# EAGLE design battleswitch_v1 (EAGLE 7.2.0)
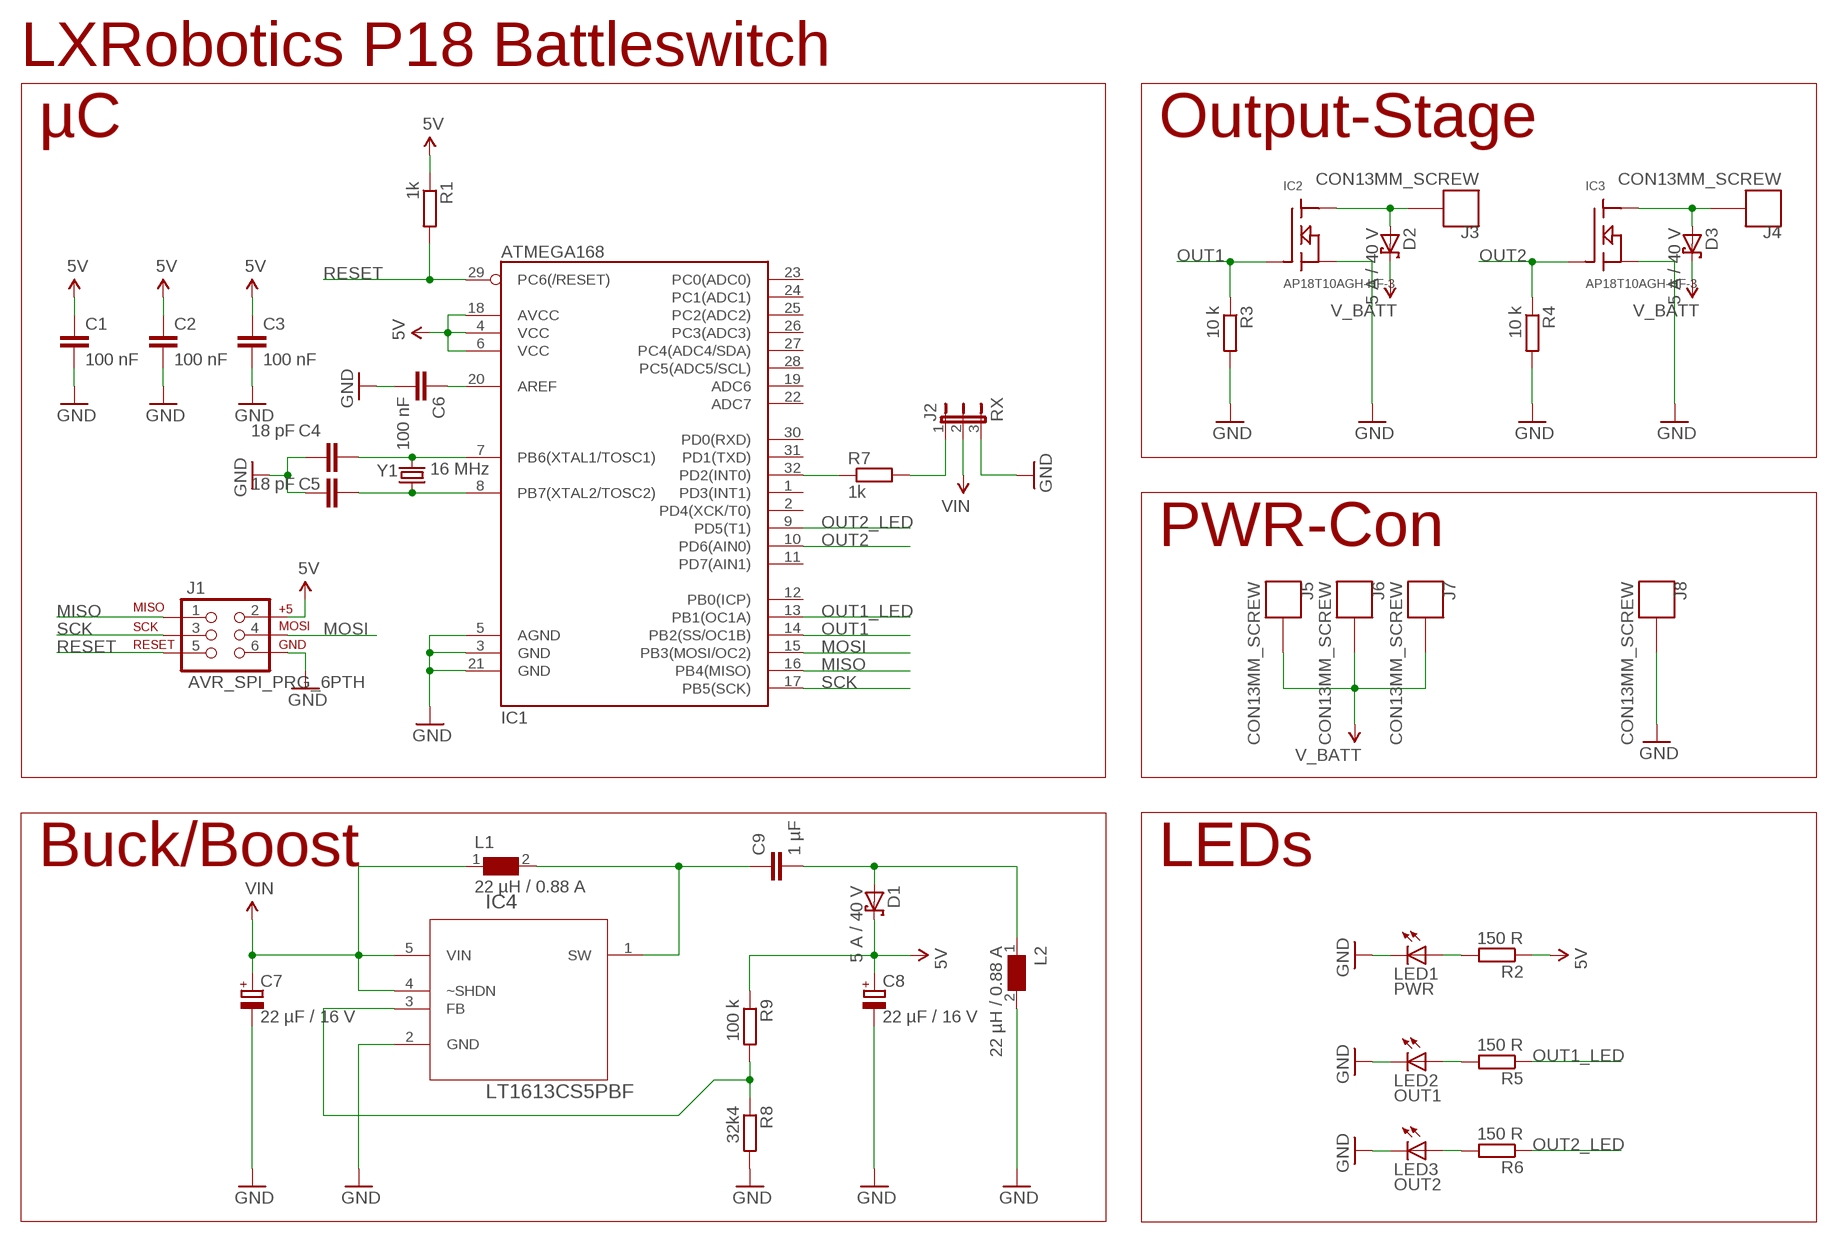
[diagram p0: schematic, sheet 1]

## Parts
C1  100 nF  C-EUC0805  [C0805]
C2  100 nF  C-EUC0805  [C0805]
C3  100 nF  C-EUC0805  [C0805]
C4  18 pF  C-EUC0805  [C0805]
C5  18 pF  C-EUC0805  [C0805]
C6  100 nF  C-EUC0805  [C0805]
C7  22 µF / 16 V  CPOL-EUC  [PANASONIC_C]
C8  22 µF / 16 V  CPOL-EUC  [PANASONIC_C]
C9  1 µF  C-EUC0805  [C0805]
D1  5 A / 40 V  SCHOTTKY-DIODESMC  [SMC]
D2  5 A / 40 V  SCHOTTKY-DIODESMC  [SMC]
D3  5 A / 40 V  SCHOTTKY-DIODESMC  [SMC]
IC1  ATMEGA168  [TQFP32-08]
IC2  AP18T10AGH-HF-3  [TO252]
IC3  AP18T10AGH-HF-3  [TO252]
IC4  LT1613CS5PBF  [SOT95P280X145-5N]
J1  AVR_SPI_PRG_6PTH  [2X3]
J2  RX  JP2E  [JP2]
J3  CON13MM_SCREW  [CON1_3MM_SCREW]
J4  CON13MM_SCREW  [CON1_3MM_SCREW]
J5  CON13MM_SCREW  [CON1_3MM_SCREW]
J6  CON13MM_SCREW  [CON1_3MM_SCREW]
J7  CON13MM_SCREW  [CON1_3MM_SCREW]
J8  CON13MM_SCREW  [CON1_3MM_SCREW]
L1  22 µH / 0.88 A  WE-TPC-744042220_4818/4828  [WE-TPC_4818/4828]
L2  22 µH / 0.88 A  WE-TPC-744042220_4818/4828  [WE-TPC_4818/4828]
LED1  PWR  LEDCHIP-LED0805  [CHIP-LED0805]
LED2  OUT1  LEDCHIP-LED0805  [CHIP-LED0805]
LED3  OUT2  LEDCHIP-LED0805  [CHIP-LED0805]
R1  1k  R-EU_R0805  [R0805]
R2  150 R  R-EU_R0805  [R0805]
R3  10 k  R-EU_R0805  [R0805]
R4  10 k  R-EU_R0805  [R0805]
R5  150 R  R-EU_R0805  [R0805]
R6  150 R  R-EU_R0805  [R0805]
R7  1k  R-EU_R0805  [R0805]
R8  32k4  R-EU_R0805  [R0805]
R9  100 k  R-EU_R0805  [R0805]
Y1  16 MHz  CRYSTALHC49US  [HC49US]

## Nets
5V: C1.1 C2.1 C3.1 C8.+ D1.C IC1.4(VCC) IC1.6(VCC) IC1.18(AVCC) J1.2 R1.1 R2.1 R9.1
GND: C1.2 C2.2 C3.2 C4.2 C5.2 C6.2 C7.- C8.- IC1.3(GND) IC1.5(AGND) IC1.21(GND) IC2.S IC3.S IC4.2(GND) J1.6 J2.3 J8.P$1 L2.2 LED1.C LED2.C LED3.C R3.2 R4.2 R8.2
MISO: IC1.16(PB4(MISO)) J1.1
MOSI: IC1.15(PB3(MOSI/OC2)) J1.4
N$1: J2.1 R7.2
N$2: C6.1 IC1.20(AREF)
N$3: IC1.32(PD2(INT0)) R7.1
N$4: LED2.A R5.2
N$5: LED3.A R6.2
N$6: D2.A IC2.D J3.P$1
N$7: D3.A IC3.D J4.P$1
N$9: C9.1 IC4.1(SW) L1.2
N$10: IC4.3(FB) R8.1 R9.2
N$11: C9.2 D1.A L2.1
N$22: C4.1 IC1.7(PB6(XTAL1/TOSC1)) Y1.2
N$23: C5.1 IC1.8(PB7(XTAL2/TOSC2)) Y1.1
N$37: LED1.A R2.2
OUT1: IC1.14(PB2(SS/OC1B)) IC2.G R3.1
OUT1_LED: IC1.13(PB1(OC1A)) R5.1
OUT2: IC1.10(PD6(AIN0)) IC3.G R4.1
OUT2_LED: IC1.9(PD5(T1)) R6.1
RESET: IC1.29(PC6(/RESET)) J1.5 R1.2
SCK: IC1.17(PB5(SCK)) J1.3
V_BATT: D2.C D3.C J5.P$1 J6.P$1 J7.P$1
VIN: C7.+ IC4.4(~SHDN) IC4.5(VIN) J2.2 L1.1
Unconnected: IC1.1(PD3(INT1)) IC1.2(PD4(XCK/T0)) IC1.11(PD7(AIN1)) IC1.12(PB0(ICP)) IC1.19(ADC6) IC1.22(ADC7) IC1.23(PC0(ADC0)) IC1.24(PC1(ADC1)) IC1.25(PC2(ADC2)) IC1.26(PC3(ADC3)) IC1.27(PC4(ADC4/SDA)) IC1.28(PC5(ADC5/SCL)) IC1.30(PD0(RXD)) IC1.31(PD1(TXD))

## Notes on the sheet
- LXRobotics P18 Battleswitch
- µC | Output-Stage
- PWR-Con
- Buck/Boost | LEDs

## Library data of the parts
C1-C6 C9 = resistor:C-EU: CAPACITOR, European symbol
C7 C8 = resistor:CPOL-EU: POLARIZED CAPACITOR, European symbol
D1-D3 = diode:SCHOTTKY-DIODE: Schottky Diode
IC1 = SparkFun-DigitalIC:ATMEGA168: Atmel 32-pin 8-bit micro, 16k flash.
IC2 IC3 = lxrobotics:AP18T10AGH-HF-3
IC4 = lxrobotics_ic:LT1613CS5PBF: DC/DC Converter; MPN: LT1613CS5#PBF; OC_FARNELL: 2115857; OC_NEWARK: 61M3347; PACKAGE: SOT-23-5; SUPPLIER: Linear Technology
J1 = SparkFun-Connectors:AVR_SPI_PRG_6: AVR ISP 6 Pin This is the reduced ISP connector for AVR programming. Common on Arduino. This footprint will take up less PCB space and can be used with a 10-pin to 6-pin adapter such as SKU: BOB-08508
J2 = jumper:JP2E: JUMPER
J3-J8 = lxrobotics_connectors:CON1
L1 L2 = WE-TPC:WE-TPC: Shielded Tiny Power Inductor WE-TPC - Extremely flat power inductor - High current capability - High reliability and perfect soldering characteristics because of integrated soldering pad - magnetically shielded -- Portable power like PDA, digital camera, PCMICA-cards and displays -- DC/DC-converter -- Recommended for switching regulator IC's from Linear Technology, National Semiconductor, Texas Instruments and Fairchild Semiconductor; MPN: 744042220; OC_FARNELL: 1635843; OC_NEWARK: 08P2481; PACKAGE: 4818; SUPPLIER: WURTH ELEKTRONIK
LED1-LED3 = led:LED: LED OSRAM: - CHIPLED LG R971, LG N971, LY N971, LG Q971, LY Q971, LO R971, LY R971 LH N974, LH R974 LS Q976, LO Q976, LY Q976 LO Q996 - Hyper CHIPLED LW Q18S LB Q993, LB Q99A, LB R99A - SideLED LS A670, LO A670, LY A670, LG A670, LP A670 LB A673, LV A673, LT A673, LW A673 LH A674 LY A675 LS A676, LA A676, LO A676, LY A676, LW A676 LS A679, LY A679, LG A679 - Hyper Micro SIDELED® LS Y876, LA Y876, LO Y876, LY Y876 LT Y87S - SmartLED LW L88C, LW L88S LB L89C, LB L89S, LG L890 LS L89K, LO L89K, LY L89K LS L896, LA L896, LO L896, LY L896 - TOPLED LS T670, LO T670, LY T670, LG T670, LP T670 LSG T670, LSP T670, LSY T670, LOP T670, LYG T670 LG T671, LOG T671, LSG T671 LB T673, LV T673, LT T673, LW T673 LH T674 LS T676, LA T676, LO T676, LY T676, LB T676, LH T676, LSB T676, LW T676 LB T67C, LV T67C, LT T67C, LS T67K, LO T67K, LY T67K, LW E67C LS E67B, LA E67B, LO E67B, LY E67B, LB E67C, LV E67C, LT E67C LW T67C LS T679, LY T679, LG T679 LS T770, LO T770, LY T770, LG T770, LP T770 LB T773, LV T773, LT T773, LW T773 LH T774 LS E675, LA E675, LY E675, LS T675 LS T776, LA T776, LO T776, LY T776, LB T776 LHGB T686 LT T68C, LB T68C - Hyper Mini TOPLED® LB M676 - Mini TOPLED Santana® LG M470 LS M47K, LO M47K, LY M47K Source: http://www.osram.convergy.de LUXEON: - LUMILED® LXK2-PW12-R00, LXK2-PW12-S00, LXK2-PW14-U00, LXK2-PW14-V00 LXK2-PM12-R00, LXK2-PM12-S00, LXK2-PM14-U00 LXK2-PE12-Q00, LXK2-PE12-R00, LXK2-PE12-S00, LXK2-PE14-T00, LXK2-PE14-U00 LXK2-PB12-K00, LXK2-PB12-L00, LXK2-PB12-M00, LXK2-PB14-N00, LXK2-PB14-P00, LXK2-PB14-Q00 LXK2-PR12-L00, LXK2-PR12-M00, LXK2-PR14-Q00, LXK2-PR14-R00 LXK2-PD12-Q00, LXK2-PD12-R00, LXK2-PD12-S00 LXK2-PH12-R00, LXK2-PH12-S00 LXK2-PL12-P00, LXK2-PL12-Q00, LXK2-PL12-R00 Source: www.luxeon.com KINGBRIGHT: KA-3528ASYC Source: www.kingbright.com
R1-R9 = resistor:R-EU_: RESISTOR, European symbol
Y1 = SparkFun-FreqCtrl:CRYSTAL: Various standard crystals. Proven footprints. Spark Fun Electronics SKU : COM-00534

## Board
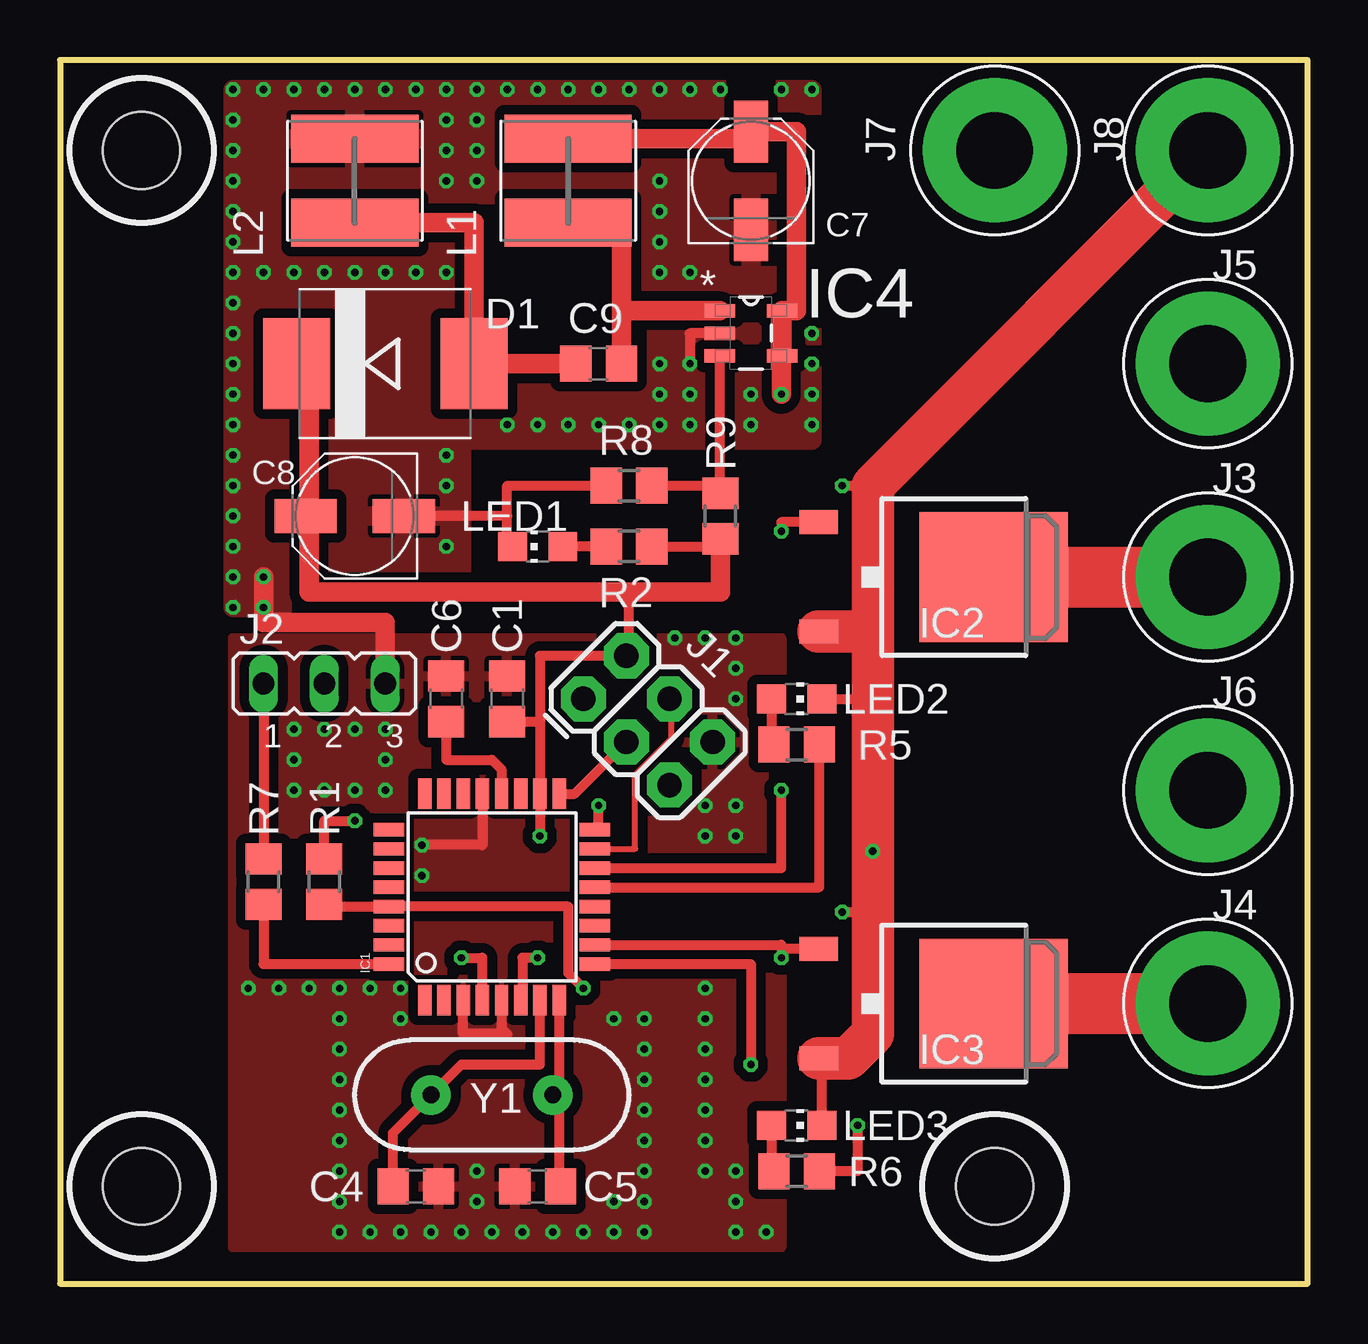
[diagram p1: board, top side]
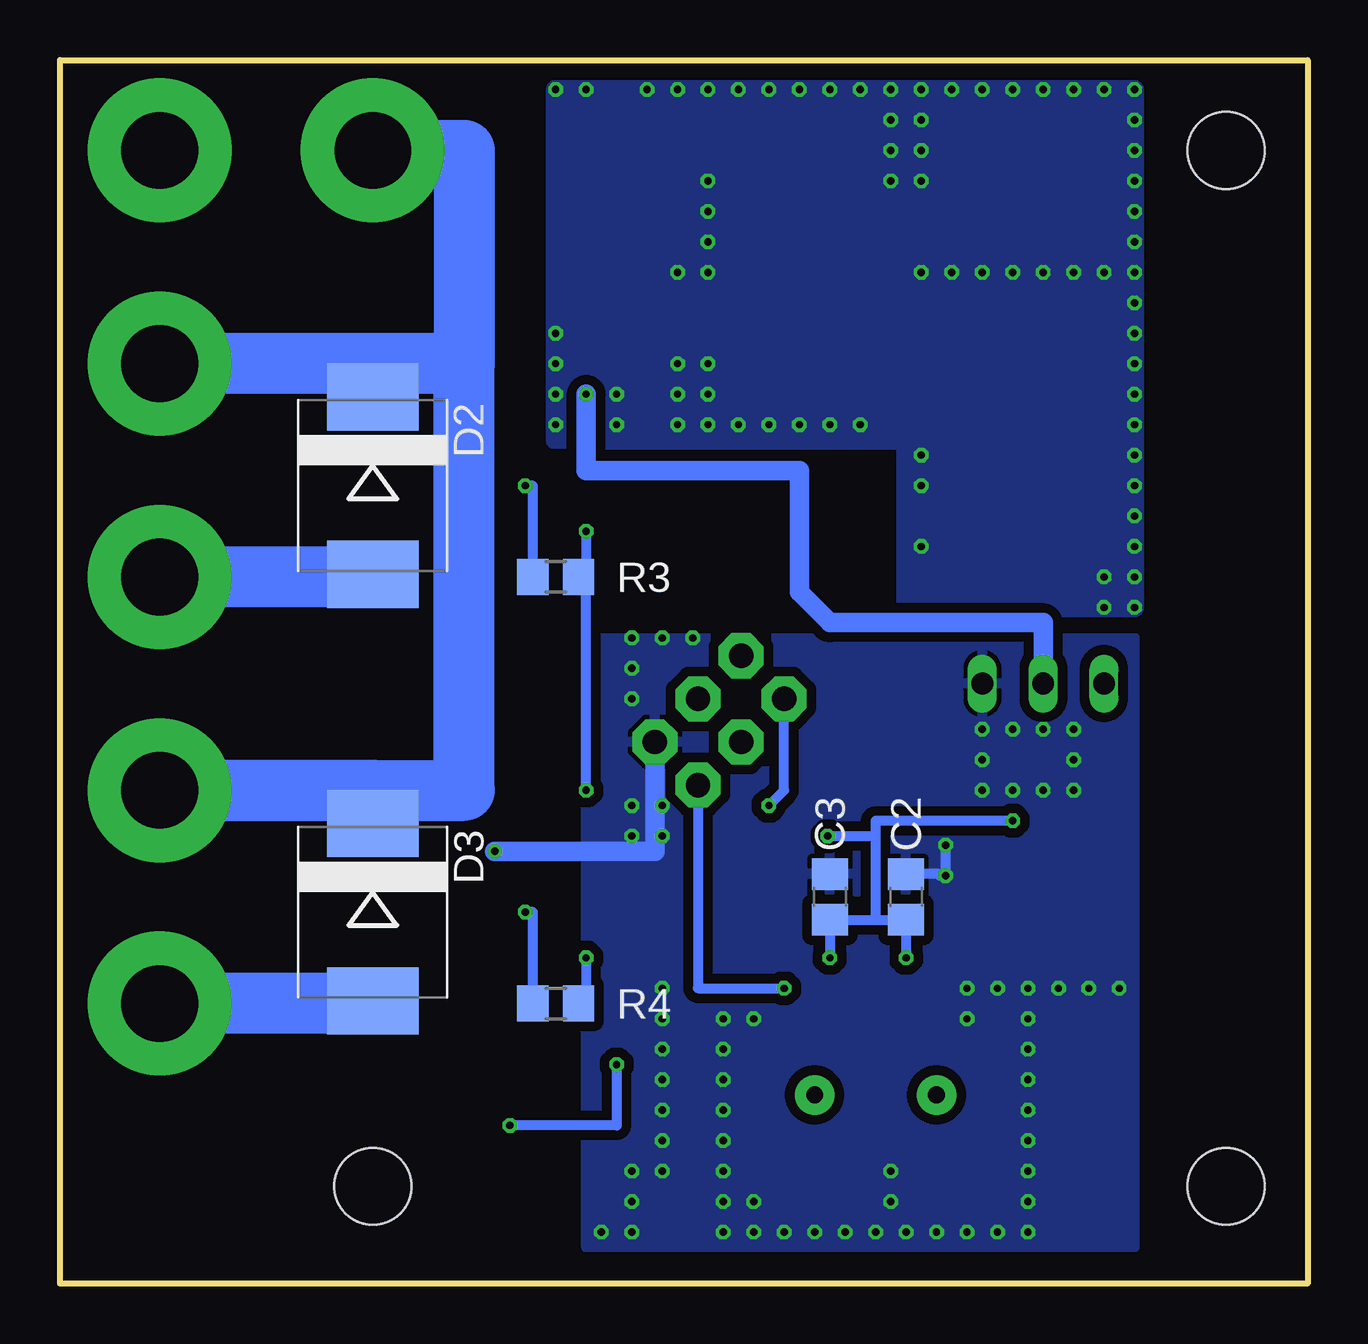
[diagram p2: board, bottom side, seen from below]

Size 52 x 51 mm. Coordinates in mm from the lower left corner, seen from the top.
Outline: 0,0 52,0 52,51 0,51 0,0
Copper layers (1*16): Top 0.035mm / dielectric 1.5mm / Bottom 0.035mm
Design rules "LeitOn - Standard-Eagle-DRU - 1- und  2-Lagen DK - deutsch - Rev 2.0": minimum track width 0.15mm, minimum drill 0.3mm, track to track 0.15mm, track to pad 0.15mm, pad to pad 0.15mm, via to via 0.15mm, smd to smd 0.15mm, copper to edge 0.3mm, drill to drill 0.3mm, minimum pad ring 0.15mm, minimum via ring 0.15mm, stop-mask expansion 0.075mm, vias tented up to drill 0mil, thermal gap 0.2mm
Holes 3.2 mm at 38.96,4.05 3.4,4.05 3.4,47.23

### Footprints (pad centres in the part's own frame; a part is rotated, then mirrored left to right if it is on the bottom)
C0805 = smd 1.3 x 1.5: 1 -0.95,0; 2 0.95,0
PANASONIC_C = smd 2.6 x 1.4: + 2.05,0; - -2.05,0
SMC = smd 2.8 x 3.8: A 3.7,0; C -3.7,0
TQFP32-08 = smd 1.27 x 0.559: 1 -4.293,2.8; 2 -4.293,2; 3 -4.293,1.2; 4 -4.293,0.4; 5 -4.293,-0.4; 6 -4.293,-1.2; 7 -4.293,-2; 8 -4.293,-2.8; 17 4.293,-2.8; 18 4.293,-2; 19 4.293,-1.2; 20 4.293,-0.4; 21 4.293,0.4; 22 4.293,1.2; 23 4.293,2; 24 4.293,2.8 | smd 0.559 x 1.27: 9 -2.8,-4.293; 10 -2,-4.293; 11 -1.2,-4.293; 12 -0.4,-4.293; 13 0.4,-4.293; 14 1.2,-4.293; 15 2,-4.293; 16 2.8,-4.293; 25 2.8,4.293; 26 2,4.293; 27 1.2,4.293; 28 0.4,4.293; 29 -0.4,4.293; 30 -1.2,4.293; 31 -2,4.293; 32 -2.8,4.293
TO252 = smd 5.4 x 6.2: D 0,2.5 | smd 1 x 1.6: G -2.28,-4.8; S 2.28,-4.8
SOT95P280X145-5N = smd 1.27 x 0.559: 1 -1.295,0.94; 2 -1.295,0; 3 -1.295,-0.94; 4 1.295,-0.94; 5 1.295,0.94
2X3 = drill 1.016 pad 1.88 octagon: 1 0,0; 2 0,2.54; 3 2.54,0; 4 2.54,2.54; 5 5.08,0; 6 5.08,2.54
JP2 = drill 0.914 long: 1 -2.54,0; 2 0,0; 3 2.54,0
CON1_3MM_SCREW = drill 3.2 pad 6: P$1 0,0
WE-TPC_4818/4828 = smd 2 x 5.3: 1 -1.75,0; 2 1.75,0
CHIP-LED0805 = smd 1.2 x 1.2: A 0,-1.05; C 0,1.05
R0805 = smd 1.3 x 1.5: 1 -0.95,0; 2 0.95,0
HC49US = drill 0.7 pad 1.651: 1 -2.54,0; 2 2.54,0

### Placement (x,y rotation side)
C1  18.64,24.37 90 top
C2  16.73,16.11 90 bottom
C3  19.91,16.11 90 bottom
C4  14.83,4.05 0 top
C5  19.91,4.05 180 top
C6  16.1,24.37 90 top
C7  28.8,45.96 90 top
C8  12.29,31.99 180 top
C9  22.45,38.34 180 top
D1  13.56,38.34 0 top
D2  38.96,33.26 270 bottom
D3  38.96,15.48 270 bottom
IC1  18.01,16.11 90 top
IC2  36.42,29.45 270 top
IC3  36.42,11.67 270 top
IC4  28.8,39.61 0 top
J1  21.81,24.37 315 top
J2  11.02,25.01 0 top
J3  47.85,29.45 0 top
J4  47.85,11.67 0 top
J5  47.85,38.34 0 top
J6  47.85,20.56 0 top
J7  38.96,47.23 0 top
J8  47.85,47.23 0 top
L1  21.18,45.96 270 top
L2  12.29,45.96 90 top
LED1  19.91,30.72 90 top
LED2  30.7,24.37 270 top
LED3  30.7,6.59 270 top
R1  11.02,16.75 270 top
R2  23.72,30.72 180 top
R3  31.34,29.45 180 bottom
R4  31.34,11.67 180 bottom
R5  30.7,22.47 180 top
R6  30.7,4.68 180 top
R7  8.48,16.75 90 top
R8  23.72,33.26 180 top
R9  27.53,31.99 90 top
Y1  18.01,7.86 180 top

### Tracks (layer width: path | path; a pad name or v marks a point on that pad's centre or on a via)
5V  (via drill 0.3)
  Top 0.406: R2.1 27.53,30.72 R9.1 | v20.01,18.66 IC1.18 20.01,23.42 | 19.27,11.82 IC1.6 arc90 19.27,11.89 19.27,13.57 v19.91,13.57 | R1.1 11.02,19.29 v12.29,19.29 | IC1.4 17.6,13.57 v16.73,13.57 | C1.1 20.01,23.42 | 20.01,23.42 20.01,26.17 J1.2 23.72,26.17 23.72,28.81
  Top 0.813: R9.1 27.53,28.81 23.72,28.81 10.38,28.81 10.38,31.84 arc90 C8.+ 9.86,31.99 10.38,32.52 10.38,38.34 D1.C
  Bottom 0.406: v12.29,19.29 18.01,19.29 18.01,18.66 | v16.73,13.57 C2.1 18.01,15.16 | v19.91,13.57 C3.1 18.01,15.16 | 18.01,18.66 18.01,15.16 | v20.01,18.66 18.01,18.66
GND  (via drill 0.3)
  Top 0.406: LED1.C 18.64,30.72 18.64,31.99 | 18.64,31.99 18.64,33.26 R8.2 | 18.64,31.99 C8.- | v32.61,33.26 33.88,33.26 | v32.61,15.48 33.88,15.48 | LED2.C 33.88,24.37 | LED3.C 31.76,9.25 IC3.S | IC1.5 18.41,10.64 18.64,10.4 16.8,10.4 IC1.3 | IC4.2 26.26,39.61 v26.26,38.34 | IC1.21 17.6,18.27 v15.08,18.27
  Top 0.813: v33.88,18.02 33.88,11.67 | v8.48,29.45 8.48,27.55 13.56,27.55 J2.3
  Top 1.778: 33.88,27.17 33.88,33.26 J8.P$1 | 33.88,27.17 33.88,24.37 v33.88,18.02 33.88,15.48 33.88,11.67 33.88,10.4 32.87,9.39 IC3.S | IC2.S 33.88,27.17
  Bottom 0.406: R3.2 32.29,33.26 v32.61,33.26 | R4.2 32.29,15.48 v32.61,15.48 | v15.08,18.27 v15.08,17 15.34,17 15.34,17.06 C2.2
  Bottom 0.813: J1.6 27.2,18.02 v33.88,18.02
  other vias: 7.21,28.18 7.21,29.45 7.21,30.72 7.21,31.99 7.21,33.26 7.21,34.53 7.21,35.8 7.21,37.07 7.21,38.34 7.21,39.61 7.21,40.88 7.21,42.15 7.21,43.42 7.21,44.69 7.21,45.96 7.21,47.23 7.21,48.5 7.21,49.77 8.48,49.77 9.75,49.77 11.02,49.77 12.29,49.77 13.56,49.77 14.83,49.77 16.1,49.77 17.37,49.77 18.64,49.77 19.91,49.77 21.18,49.77 22.45,49.77 23.72,49.77 24.99,49.77 26.26,49.77 27.53,49.77 30.07,49.77 31.34,49.77 16.1,34.53 16.1,33.26 16.1,30.72 18.64,35.8 19.91,35.8 21.18,35.8 22.45,35.8 23.72,35.8 24.99,35.8 26.26,35.8 28.8,35.8 26.9,18.66 31.34,35.8 31.34,37.07 31.34,38.34 31.34,39.61 12.29,23.1 11.02,23.1 13.56,21.83 24.99,45.96 24.99,44.69 24.99,43.42 24.99,42.15 26.26,42.15 17.37,48.5 17.37,47.23 17.37,45.96 16.1,45.96 16.1,47.23 16.1,48.5 16.1,42.15 14.83,42.15 8.48,28.18 13.56,42.15 12.29,42.15 11.02,42.15 9.75,42.15 8.48,42.15 24.99,37.07 24.99,38.34 26.26,37.07 28.8,37.07 13.56,23.1 9.75,21.83 9.75,23.1 13.56,20.56 12.29,20.56 28.16,18.66 28.16,19.92 11.66,2.14 12.92,2.14 14.2,2.14 15.47,2.14 16.73,2.14 18.01,2.14 17.37,3.41 17.37,4.68 19.27,2.14 20.55,2.14 21.81,2.14 23.09,2.14 24.35,2.14 28.16,25.64 28.16,26.91 26.9,26.91 25.62,26.91 28.16,3.41 28.16,4.68 26.9,4.68 26.9,5.95 26.9,7.23 26.9,8.5 29.44,2.14 28.16,2.14 28.16,24.37 24.35,11.04 23.09,11.04 24.35,9.77 24.35,8.5 24.35,7.23 24.35,5.95 24.35,4.68 23.09,3.41 24.35,3.41 11.02,20.56 9.75,20.56 11.66,12.3 12.92,12.3 14.2,12.3 14.2,11.04 11.66,11.04 11.66,9.77 11.66,8.5 11.66,7.23 11.66,5.95 11.66,4.68 11.66,3.41 26.9,19.92 10.38,12.3 9.11,12.3 7.84,12.3 26.9,9.77 26.9,11.04 26.9,12.3
  pour Top (isolate 0.406): 7.21,49.77 7.21,28.18 16.73,28.18 16.73,35.16 31.34,35.16 31.34,49.77
  pour Bottom (isolate 0.406): 7.21,28.18 16.73,28.18 16.73,35.16 31.34,35.16 31.34,49.77 7.21,49.77
  pour Top (isolate 0.406): 7.21,26.91 30.07,26.91 30.07,3.41 30.07,1.51 7.21,1.51
  pour Bottom (isolate 0.406): 7.21,1.51 30.07,1.51 30.07,26.91 7.21,26.91
MISO  (via drill 0.3)
  Top 0.406: IC1.16 22.45,19.07 v22.45,19.92
  Bottom 0.406: v22.45,19.92 21.81,20.56 J1.1
MOSI
  Top 0.254: IC1.15 23.97,18.12 23.97,21.2 25.5,22.72 25.5,24.28 J1.4
N$1
  Top 0.406: J2.1 R7.2
N$2
  Top 0.406: C6.1 16.1,21.83 18.01,21.83 18.41,21.43 IC1.20
N$3
  Top 0.406: R7.1 8.48,13.32 IC1.32
N$4
  Top 0.406: LED2.A 29.66,22.56 R5.2
N$5
  Top 0.406: LED3.A 29.66,4.79 R6.2
N$6
  Top 2.54: IC2.D J3.P$1
  Bottom 2.54: D2.A 38.96,29.45 J3.P$1
N$7
  Top 2.54: IC3.D J4.P$1
  Bottom 2.54: D3.A 38.96,11.67 J4.P$1
N$9
  Top 0.813: L1.2 23.4,44.21 23.4,40.55 | 23.4,40.55 C9.1 | IC4.1 23.4,40.55
N$10
  Top 0.406: IC4.3 27.51,32.97 R9.2 27.53,33.26 R8.1
N$11
  Top 0.813: C9.2 D1.A 17.26,44.21 L2.1
N$22
  Top 0.406: C4.1 13.88,6.27 Y1.2 16.73,9.13 20.01,9.13 IC1.7
N$23
  Top 0.406: IC1.8 20.8,7.86 | 20.8,7.86 20.8,4.11 arc90 C5.1 | Y1.1 20.8,7.86
N$37
  Top 0.406: R2.2 LED1.A
OUT1  (via drill 0.3)
  Top 0.406: IC2.G 30.07,31.73 v30.07,31.35 | IC1.14 30.07,17.31 v30.07,20.56
  Bottom 0.406: v30.07,31.35 30.07,29.77 R3.1 30.07,29.45 v30.07,20.56
OUT1_LED
  Top 0.406: IC1.13 31.66,16.52 R5.1
OUT2  (via drill 0.3)
  Top 0.406: IC3.G 30.07,13.95 v30.07,13.57 30.07,14.11 IC1.10
  Bottom 0.406: v30.07,13.57 30.07,11.99 R4.1
OUT2_LED  (via drill 0.3)
  Top 0.406: IC1.9 28.8,13.32 v28.8,9.13 | v33.24,6.59 33.24,4.68 R6.1
  Bottom 0.406: v28.8,9.13 28.8,6.59 v33.24,6.59
RESET  (via drill 0.3)
  Top 0.406: R1.2 11.02,15.71 IC1.29 21.18,15.71 21.18,12.94 v21.81,12.3
  Bottom 0.406: J1.5 25.41,12.3 v21.81,12.3
SCK
  Top 0.406: IC1.17 21.45,20.41 J1.3
V_BATT
  Bottom 2.54: D3.C 38.96,20.56 J6.P$1 35.15,20.56 35.15,38.34 | D2.C 38.96,38.34 | 38.96,38.34 J5.P$1 | 35.15,38.34 38.96,38.34 | J7.P$1 35.15,47.23 35.15,38.34
VIN  (via drill 0.3)
  Top 0.813: L1.1 28.8,47.71 C7.+ 30.7,48.01 30.7,40.55 IC4.5 IC4.4 30.07,38.65 v30.07,37.07
  Bottom 0.813: J2.2 11.02,27.55 19.91,27.55 21.18,28.81 21.18,33.9 30.07,33.9 v30.07,37.07